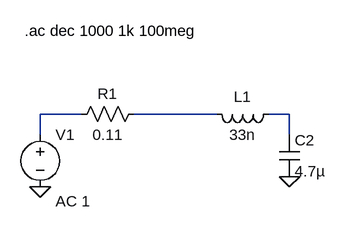
[diagram p0: schematic pushpull-filter.asc]
pushpull-filter.asc, the LTspice schematic file:
Version 4
SHEET 1 880 680
WIRE 224 272 160 272
WIRE 432 272 304 272
WIRE 544 272 512 272
WIRE 160 304 160 272
WIRE 544 304 544 272
FLAG 544 368 0
FLAG 160 384 0
SYMBOL voltage 160 288 R0
WINDOW 123 24 118 Left 2
SYMATTR InstName V1
SYMATTR Value ""
SYMATTR Value2 AC 1
SYMBOL res 320 256 R90
WINDOW 0 0 56 VBottom 2
WINDOW 3 32 56 VTop 2
SYMATTR InstName R1
SYMATTR Value 0.11
SYMBOL cap 528 304 R0
SYMATTR InstName C2
SYMATTR Value 4.7µ
SYMATTR SpiceLine Rser=18.3m Lser=0 mfg="KEMET" pn="C1206C475K4PAC" type="X5R"
SYMBOL ind 528 256 R90
WINDOW 0 5 56 VBottom 2
WINDOW 3 32 56 VTop 2
SYMATTR InstName L1
SYMATTR Value 33n
SYMATTR SpiceLine Ipk=600m Rser=330m Rpar=28.527K Cpar=0 mfg="Coilcraft" pn="0603CT-33N"
TEXT 136 144 Left 2 !.ac dec 1000 1k 100meg

The netlist it stands for:
* pushpull-filter.asc
V1 N001 0 AC 1
R1 N002 N001 0.11
C2 N003 0 4.7µ Rser=18.3m Lser=0 mfg="KEMET" pn="C1206C475K4PAC" type="X5R"
L1 N003 N002 33n Ipk=600m Rser=330m Rpar=28.527K Cpar=0 mfg="Coilcraft" pn="0603CT-33N"
.ac dec 1000 1k 100meg
.backanno
.end